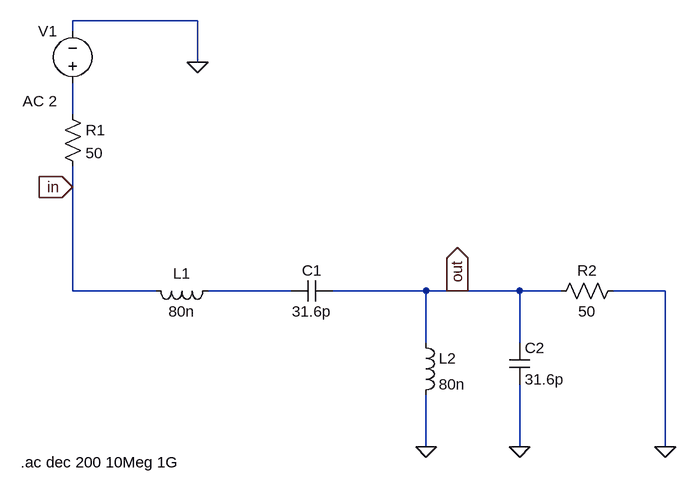
[diagram p0: schematic bant_geçiren_filtre.asc]
bant_geçiren_filtre.asc, the LTspice schematic file:
Version 4.1
SHEET 1 948 728
WIRE 208 32 16 32
WIRE 16 48 16 32
WIRE 208 96 208 32
WIRE 16 176 16 128
WIRE 16 288 16 256
WIRE 16 448 16 288
WIRE 144 448 16 448
WIRE 352 448 224 448
WIRE 560 448 416 448
WIRE 608 448 560 448
WIRE 704 448 608 448
WIRE 768 448 704 448
WIRE 928 448 848 448
WIRE 560 528 560 448
WIRE 704 528 704 448
WIRE 560 688 560 608
WIRE 704 688 704 592
WIRE 928 688 928 448
FLAG 16 288 in
IOPIN 16 288 In
FLAG 208 96 0
FLAG 560 688 0
FLAG 704 688 0
FLAG 608 448 out
IOPIN 608 448 Out
FLAG 928 688 0
SYMBOL voltage 16 144 R180
WINDOW 0 24 96 Left 2
WINDOW 3 24 16 Left 2
WINDOW 123 24 -12 Left 2
WINDOW 39 0 0 Left 0
SYMATTR InstName V1
SYMATTR Value ""
SYMATTR Value2 AC 2
SYMBOL res 0 160 R0
SYMATTR InstName R1
SYMATTR Value 50
SYMBOL ind 240 432 R90
WINDOW 0 5 56 VBottom 2
WINDOW 3 32 56 VTop 2
SYMATTR InstName L1
SYMATTR Value 80n
SYMATTR SpiceLine Rser=1m
SYMBOL cap 416 432 R90
WINDOW 0 0 32 VBottom 2
WINDOW 3 32 32 VTop 2
SYMATTR InstName C1
SYMATTR Value 31.6p
SYMBOL ind 544 512 R0
SYMATTR InstName L2
SYMATTR Value 80n
SYMATTR SpiceLine Rser=1m
SYMBOL cap 688 528 R0
SYMATTR InstName C2
SYMATTR Value 31.6p
SYMBOL res 864 432 R90
WINDOW 0 0 56 VBottom 2
WINDOW 3 32 56 VTop 2
SYMATTR InstName R2
SYMATTR Value 50
TEXT -64 712 Left 2 !.ac dec 200 10Meg 1G

The netlist it stands for:
* bant_geçiren_filtre.asc
V1 N001 0 AC 2
R1 N001 in 50
L1 N002 in 80n Rser=1m
C1 out N002 31.6p
L2 out 0 80n Rser=1m
C2 out 0 31.6p
R2 0 out 50
.ac dec 200 10Meg 1G
.backanno
.end

* Results of the author's LTspice run, read from the files saved beside the schematic
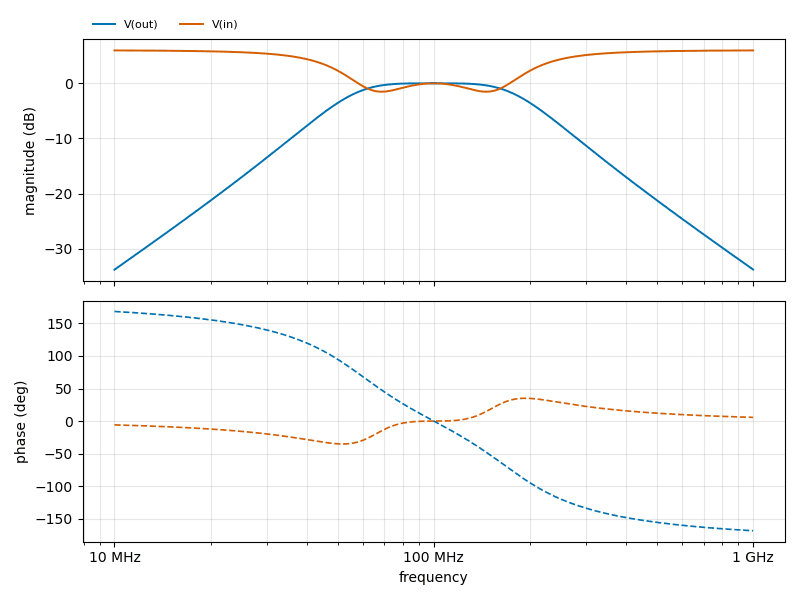
[diagram p1: AC Analysis of bant_geçiren_filtre.asc, plotted from the saved traces]
* AC Analysis, 1 run:
*   V(out): -33.82 dB at 10 MHz, -33.79 dB at 1 GHz, peak -0.00 dB at 101.2 MHz, 3 dB below the peak at 51.82 MHz and 193.4 MHz
*   V(in): 5.98 dB at 10 MHz, 5.98 dB at 1 GHz, peak 5.98 dB at 10 MHz, 3 dB below the peak at 47.43 MHz